# EAGLE schematic EEZ PSU Arduino shield+BP r3B4 (EAGLE 6.1)
Assembly variants: Farnell, TME

## Sheet 1 of 5: Binding posts relays, LED driver
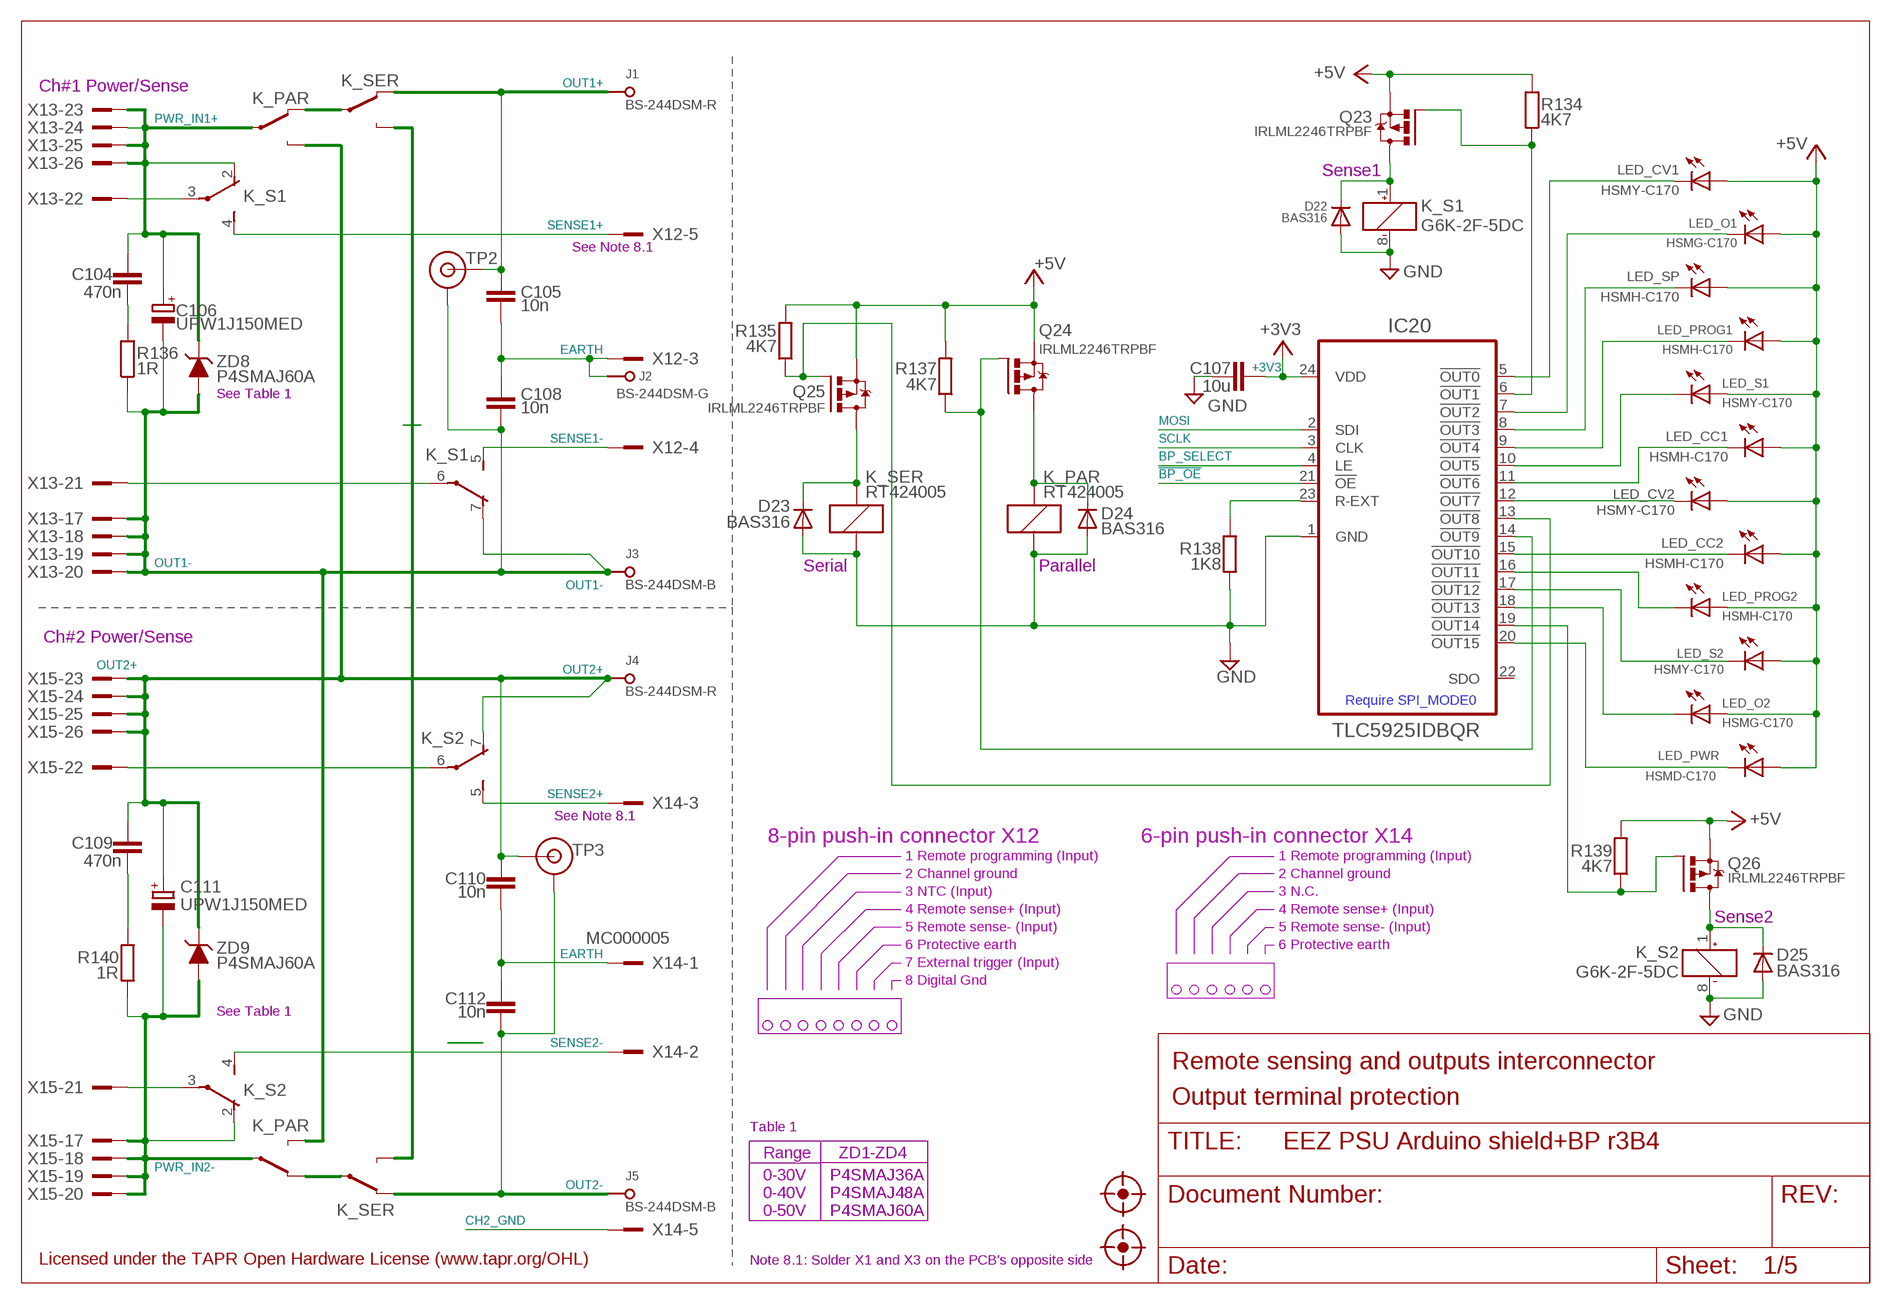
[diagram p0: schematic, sheet 1]

### Parts
C104  470n  C-EUC0805  [C0805]
C105  10n  C-EUC0805  [C0805]
C106  UPW1J150MED  ECAPEEEFK+2.5MM  [CAPAE660X610N_COMBO2]
C107  10u  C-EUC1210  [C1210]
C108  10n  C-EUC0805  [C0805]
C109  470n  C-EUC0805  [C0805]
C110  10n  C-EUC0805  [C0805]
C111  UPW1J150MED  ECAPEEEFK+2.5MM  [CAPAE660X610N_COMBO2]
C112  10n  C-EUC0805  [C0805]
D22  BAS316  DIODE-SOD323-W  [SOD323-W]
D23  BAS316  DIODE-SOD323-W  [SOD323-W]
D24  BAS316  DIODE-SOD323-W  [SOD323-W]
D25  BAS316  DIODE-SOD323-W  [SOD323-W]
FM5  FIDUCIAL_2  [FIDUCIAL_DUAL]
FM6  FIDUCIAL_2  [FIDUCIAL_DUAL]
IC20  TLC5925IDBQR  [SOP63P600X175-24N]
J1  BS-244DSM-R  BINDING_POST-2  [BP_5_12]
J2  BS-244DSM-G  BINDING_POST-2  [BP_5_12]
J3  BS-244DSM-B  BINDING_POST-2  [BP_5_12]
J4  BS-244DSM-R  BINDING_POST-2  [BP_5_12]
J5  BS-244DSM-B  BINDING_POST-2  [BP_5_12]
K_PAR  RT424005  RELAY_RT314012-2  [RT-C/016A5_ROUND]
K_S1  G6K-2F-5DC  G6K-2F  [G6K-2F]
K_S2  G6K-2F-5DC  G6K-2F  [G6K-2F]
K_SER  RT424005  RELAY_RT314012-2  [RT-C/016A5_ROUND]
LED_CC1  HSMH-C170  LED0805  [LED_0805]
LED_CC2  HSMH-C170  LED0805  [LED_0805]
LED_CV1  HSMY-C170  LED0805  [LED_0805]
LED_CV2  HSMY-C170  LED0805  [LED_0805]
LED_O1  HSMG-C170  LED0805  [LED_0805]
LED_O2  HSMG-C170  LED0805  [LED_0805]
LED_PROG1  HSMH-C170  LED0805  [LED_0805]
LED_PROG2  HSMH-C170  LED0805  [LED_0805]
LED_PWR  HSMD-C170  LED0805  [LED_0805]
LED_S1  HSMY-C170  LED0805  [LED_0805]
LED_S2  HSMY-C170  LED0805  [LED_0805]
LED_SP  HSMH-C170  LED0805  [LED_0805]
Q23  IRLML2246TRPBF  [SOT95P237X112-3N]
Q24  IRLML2246TRPBF  [SOT95P237X112-3N]
Q25  IRLML2246TRPBF  [SOT95P237X112-3N]
Q26  IRLML2246TRPBF  [SOT95P237X112-3N]
R134  4K7  R-EU_R0805  [R0805]
R135  4K7  R-EU_R0805  [R0805]
R136  1R  R-EU_R0805  [R0805]
R137  4K7  R-EU_R0805  [R0805]
R138  1K8  R-EU_R0805  [R0805]
R139  4K7  R-EU_R0805  [R0805]
R140  1R  R-EU_R0805  [R0805]
TP2  TEST_POINT  [TP_1.1MM]
TP3  TEST_POINT  [TP_1.1MM]
X12  MC000006  MC000006MIRROR  [MC000006_MIRROR]
X13  TSW-113-07-F-D  [TSW-113-07-F-D]
X14  MC000005  MC000005MIRROR  [MC000005_MIRROR]
X15  TSW-113-07-F-D  [TSW-113-07-F-D]
ZD8  P4SMAJ60A  PSMAXX  [DO214AC]
ZD9  P4SMAJ60A  PSMAXX  [DO214AC]

### Nets
!BP_OE: IC20.21(!OE) ; also sheet 2
!BP_OUT0: IC20.5(!OUT0) LED_CV1.C
!BP_OUT1: IC20.6(!OUT1) Q23.1(G) R134.1
!BP_OUT2: IC20.7(!OUT2) LED_O1.C
!BP_OUT3: IC20.8(!OUT3) LED_SP.C
!BP_OUT4: IC20.9(!OUT4) LED_PROG1.C
!BP_OUT5: IC20.10(!OUT5) LED_S1.C
!BP_OUT6: IC20.11(!OUT6) LED_CC1.C
!BP_OUT7: IC20.12(!OUT7) LED_CV2.C
!BP_OUT8: IC20.13(!OUT8) Q25.1(G) R135.1
!BP_OUT9: IC20.14(!OUT9) Q24.1(G) R137.1
!BP_OUT10: IC20.15(!OUT10) LED_CC2.C
!BP_OUT12: IC20.17(!OUT12) LED_S2.C
!BP_OUT13: IC20.18(!OUT13) LED_O2.C
!BP_OUT14: IC20.19(!OUT14) Q26.1(G) R139.1
!BP_OUT15: IC20.20(!OUT15) LED_PWR.C
+3V3: C107.1 IC20.24(VDD) ; also sheet 2,3,4,5
+5V: LED_CC1.A LED_CC2.A LED_CV1.A LED_CV2.A LED_O1.A LED_O2.A LED_PROG1.A LED_PROG2.A LED_PWR.A LED_S1.A LED_S2.A LED_SP.A Q23.2(S) Q24.2(S) Q25.2(S) Q26.2(S) R134.2 R135.2 R137.2 R139.2 ; also sheet 2,3,4,5
BP_SELECT: IC20.4(LE) ; also sheet 2
CH2_GND: X14.5 X14.5.1 ; also sheet 2,4
EARTH: C105.2 C108.1 C110.2 C112.1 J2.P$1 X12.3 X12.3.1 X14.1 X14.1.1 ; also sheet 3
GND [gnd]: C107.2 D22.A D23.A D24.A D25.A IC20.1(GND) K_PAR.A1(K:C2) K_S1.8(1:-) K_S2.8(1:-) K_SER.A1(K:C2) R138.1 ; also sheet 2,3,4,5
MOSI: IC20.2(SDI) ; also sheet 2,3,5
N$92: D22.C K_S1.1(1:+) Q23.3(D)
N$93: D25.C K_S2.1(1:+) Q26.3(D)
N$94: C104.2 R136.2
N$95: C109.2 R140.2
N$96: IC20.16(!OUT11) LED_PROG2.C
N$97: K_SER.14A(-1:O) K_SER.14B(-2:O)
N$98: K_PAR.12A(-1:S) K_SER.11B(-2:P)
N$99: K_PAR.12B(-2:S) K_SER.11A(-1:P)
N$155: D23.C K_SER.A2(K:C1) Q25.3(D)
N$156: D24.C K_PAR.A2(K:C1) Q24.3(D)
N$306: IC20.23(R-EXT) R138.2
OUT1+: C105.1 J1.P$1 K_SER.12B(-2:S) TP2.TIP
OUT1-: C106.2(-) C106.2.1(-) C108.2 J3.P$1 K_PAR.14B(-2:O) K_S1.7(3:O) R136.1 TP2.GND X13.17 X13.18 X13.19 X13.20 ZD8.A
OUT2+: C109.1 C110.1 C111.1(+) C111.1.1(+) J4.P$1 K_PAR.14A(-1:O) K_S2.7(3:O) TP3.TIP X15.23 X15.24 X15.25 X15.26 ZD9.C
OUT2-: C112.2 J5.P$1 K_SER.12A(-1:S) TP3.GND
PWR_IN1+: C104.1 C106.1(+) C106.1.1(+) K_PAR.11A(-1:P) K_S1.2(2:O) X13.23 X13.24 X13.25 X13.26 ZD8.C
PWR_IN2-: C111.2(-) C111.2.1(-) K_PAR.11B(-2:P) K_S2.2(2:O) R140.1 X15.17 X15.18 X15.19 X15.20 ZD9.A
SCLK: IC20.3(CLK) ; also sheet 2,3,5
SENSE1+: K_S1.4(2:S) X12.5 X12.5.1
SENSE1-: K_S1.5(3:S) X12.4 X12.4.1
SENSE1_IN+: K_S1.3(2:P) X13.22
SENSE1_IN-: K_S1.6(3:P) X13.21
SENSE2+: K_S2.5(3:S) X14.3 X14.3.1
SENSE2-: K_S2.4(2:S) X14.2 X14.2.1
SENSE2_IN+: K_S2.6(3:P) X15.22
SENSE2_IN-: K_S2.3(2:P) X15.21
Unconnected: IC20.22(SDO) X14.4 X14.4.1

### Notes on the sheet
- Ch#1 Power/Sense
- Sense1
- See Note 8.1
- See Table 1
- Serial | Parallel
- Ch#2 Power/Sense
- Require SPI_MODE0
- See Note 8.1
- 8-pin push-in connector X12 | 6-pin push-in connector X14
- 1 Remote programming (Input) | 1 Remote programming (Input)
- 2 Channel ground | 2 Channel ground
- 3 NTC (Input) | 3 N.C.
- 4 Remote sense+ (Input) | 4 Remote sense+ (Input)
- Sense2
- 5 Remote sense- (Input) | 5 Remote sense- (Input)
- 6 Protective earth | 6 Protective earth
- 7 External trigger (Input)
- 8 Digital Gnd
- See Table 1
- Remote sensing and outputs interconnector
- Output terminal protection
- Table 1
- Range | ZD1-ZD4
- 0-30V | P4SMAJ36A
- 0-40V | P4SMAJ48A
- 0-50V | P4SMAJ60A
- Licensed under the TAPR Open Hardware License (www.tapr.org/OHL) | Note 8.1: Solder X1 and X3 on the PCB's opposite side

## Sheet 2 of 5: Isolators, Arduino
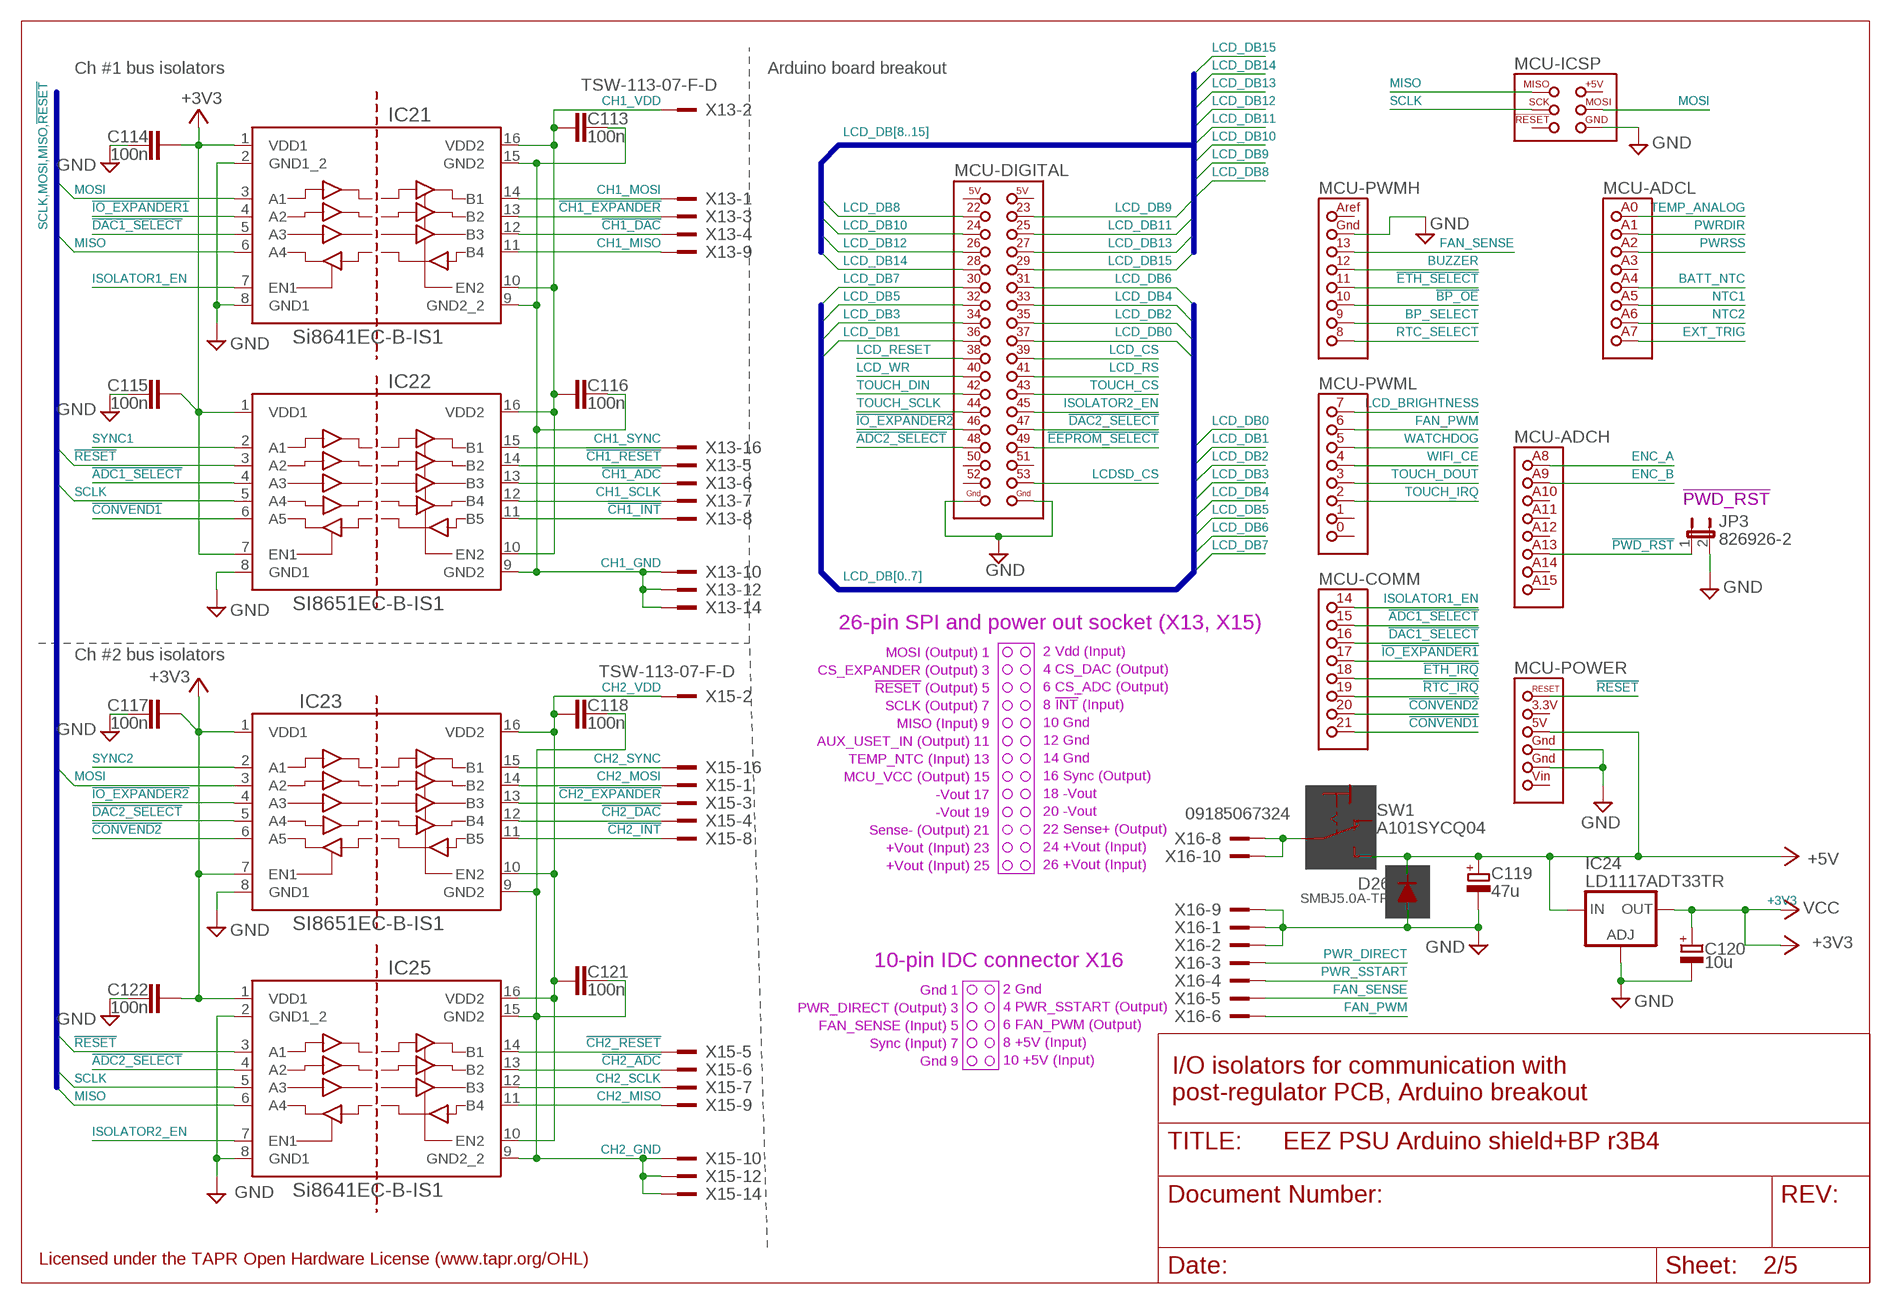
[diagram p1: schematic, sheet 2]

### Parts
C113  100n  C-EUC0603  [C0603]
C114  100n  C-EUC0603  [C0603]
C115  100n  C-EUC0603  [C0603]
C116  100n  C-EUC0603  [C0603]
C117  100n  C-EUC0603  [C0603]
C118  100n  C-EUC0603  [C0603]
C119  47u  ECAPPANASONIC_H  [CAPAE660X610N]
C120  10u  ECAPPANASONIC_C  [PANASONIC_C]
C121  100n  C-EUC0603  [C0603]
C122  100n  C-EUC0603  [C0603]
D26  SMBJ5.0A-TR  DIODEDO214AA  [DO214AA]
IC21  Si8641EC-B-IS1  SI8641NSOIC-16  [SOIC-16]
IC22  SI8651EC-B-IS1  SI8651NSOIC-16  [SOIC-16]
IC23  SI8651EC-B-IS1  SI8651NSOIC-16  [SOIC-16]
IC24  LD1117ADT33TR  LD117ADT33TR  [DPACK]
IC25  Si8641EC-B-IS1  SI8641NSOIC-16  [SOIC-16]
JP3  826926-2  JP1E  [JP1]
MCU  Arduino Due  ARDUINO_MEGA+ICSPMIRROR  [ARDUINO+ICSP_MIRROR]
SW1  A101SYCQ04  M9040P  [M9040P]
X16  09185067324  IDC-10PINBLACK  [IDC-10PIN]

### Nets
!ADC1_SELECT: IC22.4(A3) MCU.15
!ADC2_SELECT: IC25.4(A2) MCU.48(-DIGITAL:48(PL3))
!BP_OE: MCU.10 ; also sheet 1
!CH1_ADC: IC22.13(B3) X13.6
!CH1_DAC: IC21.12(B3) X13.4
!CH1_EXPANDER: IC21.13(B2) X13.3
!CH1_INT: IC22.11(B5) X13.8
!CH1_RESET: IC22.14(B2) X13.5
!CH2_ADC: IC25.13(B2) X15.6
!CH2_DAC: IC23.12(B4) X15.4
!CH2_EXPANDER: IC23.13(B3) X15.3
!CH2_INT: IC23.11(B5) X15.8
!CH2_RESET: IC25.14(B1) X15.5
!CONVEND1: IC22.6(A5) MCU.21
!CONVEND2: IC23.6(A5) MCU.20
!DAC1_SELECT: IC21.5(A3) MCU.16
!DAC2_SELECT: IC23.5(A4) MCU.47(-DIGITAL:47(PL4))
!EEPROM_SELECT: MCU.49(-DIGITAL:49(PL2)) ; also sheet 3
!ETH_IRQ: MCU.18 ; also sheet 3,5
!ETH_SELECT: MCU.11 ; also sheet 3,5
!IO_EXPANDER1: IC21.4(A2) MCU.17
!IO_EXPANDER2: IC23.4(A3) MCU.46(-DIGITAL:46(PL5))
!PWD_RST: JP3.1 MCU.A13(-ADCH:ADC13)
!RESET: IC22.3(A2) IC25.3(A1) MCU.RESET(-POWER:!RESET) ; also sheet 3,4,5
!RTC_IRQ: MCU.19 ; also sheet 3
+3V3: C114.1 C115.1 C117.1 C120.1(+) C122.1 IC21.1(VDD1) IC22.1(VDD1) IC22.7(EN1) IC23.1(VDD1) IC23.7(EN1) IC24.4(OUT) IC25.1(VDD1) ; supply symbol labelled VCC ; also sheet 1,3,4,5
+5V: C119.1(+) D26.C IC24.3(IN) MCU.5V(-POWER:5V) SW1.3(S) ; also sheet 1,3,4,5
BATT_NTC: MCU.A4(-ADCL:ADC4) ; also sheet 4
BP_SELECT: MCU.9(-PWMH:9(PH6)) ; also sheet 1
BUZZER: MCU.12 ; also sheet 3
CH1_GND: C113.2 C116.2 IC21.9(GND2_2) IC21.15(GND2) IC22.9(GND2) X13.10 X13.12 X13.14 ; also sheet 4
CH1_MISO: IC21.11(B4) X13.9
CH1_MOSI: IC21.14(B1) X13.1
CH1_SCLK: IC22.12(B4) X13.7
CH1_SYNC: IC22.15(B1) X13.16
CH1_VDD: C113.1 C116.1 IC21.10(EN2) IC21.16(VDD2) IC22.10(EN2) IC22.16(VDD2) X13.2 ; also sheet 4
CH2_GND: C118.2 C121.2 IC23.9(GND2) IC25.9(GND2_2) IC25.15(GND2) X15.10 X15.12 X15.14 ; also sheet 1,4
CH2_MISO: IC25.11(B4) X15.9
CH2_MOSI: IC23.14(B2) X15.1
CH2_SCLK: IC25.12(B3) X15.7
CH2_SYNC: IC23.15(B1) X15.16
CH2_VDD: C118.1 C121.1 IC23.10(EN2) IC23.16(VDD2) IC25.10(EN2) IC25.16(VDD2) X15.2
ENC_A: MCU.A8(-ADCH:ADC8) ; also sheet 5
ENC_B: MCU.A9(-ADCH:ADC9) ; also sheet 5
EXT_TRIG: MCU.A7(-ADCL:ADC7) ; also sheet 4
FAN_PWM: MCU.6(-PWML:6(PH3)) X16.6
FAN_SENSE: MCU.13 X16.5
GND [gnd]: C114.2 C115.2 C117.2 C119.2(-) C120.2(-) C122.2 D26.A IC21.2(GND1_2) IC21.8(GND1) IC22.8(GND1) IC23.8(GND1) IC24.1(ADJ) IC25.2(GND1_2) IC25.8(GND1) JP3.2 MCU.GND1(-POWER:GND1) MCU.GND2(-POWER:GND2) MCU.GND3(-DIGITAL:GND3) MCU.GND4(-DIGITAL:GND4) MCU.GND(-PWMH:GND) MCU.ICSP_GND(-ICSP:GND) X16.1 X16.2 X16.9 ; also sheet 1,3,4,5
ISOLATOR1_EN: IC21.7(EN1) MCU.14
ISOLATOR2_EN: IC25.7(EN1) MCU.45(-DIGITAL:45(PL6))
LCD_BRIGHTNESS: MCU.7(-PWML:7(PH4)) ; also sheet 3
LCD_CS: MCU.39(-DIGITAL:39(PC0)) ; also sheet 3
LCD_DB0: MCU.37(-DIGITAL:37(PC2)) ; also sheet 3
LCD_DB1: MCU.36(-DIGITAL:36(PC3)) ; also sheet 3
LCD_DB2: MCU.35(-DIGITAL:35(PC4)) ; also sheet 3
LCD_DB3: MCU.34(-DIGITAL:34(PC5)) ; also sheet 3
LCD_DB4: MCU.33(-DIGITAL:33(PC6)) ; also sheet 3
LCD_DB5: MCU.32(-DIGITAL:32(PC7)) ; also sheet 3
LCD_DB6: MCU.31(-DIGITAL:31(PA7)) ; also sheet 3
LCD_DB7: MCU.30(-DIGITAL:30(PA6)) ; also sheet 3
LCD_DB8: MCU.22 ; also sheet 3
LCD_DB9: MCU.23 ; also sheet 3
LCD_DB10: MCU.24(-DIGITAL:24(PA0)) ; also sheet 3
LCD_DB11: MCU.25(-DIGITAL:25(PA1)) ; also sheet 3
LCD_DB12: MCU.26(-DIGITAL:26(PA2)) ; also sheet 3
LCD_DB13: MCU.27(-DIGITAL:27(PA3)) ; also sheet 3
LCD_DB14: MCU.28(-DIGITAL:28(PA4)) ; also sheet 3
LCD_DB15: MCU.29(-DIGITAL:29(PA5)) ; also sheet 3
LCD_RESET: MCU.38(-DIGITAL:38(PC1)) ; also sheet 3
LCD_RS: MCU.41(-DIGITAL:41(PG2)) ; also sheet 3
LCD_WR: MCU.40(-DIGITAL:40(PD7)) ; also sheet 3
LCDSD_CS: MCU.53(-DIGITAL:53(PB2/MOSI)) ; also sheet 3
MISO: IC21.6(A4) IC25.6(A4) MCU.ICSP_MISO(-ICSP:MISO) ; also sheet 3,5
MOSI: IC21.3(A1) IC23.3(A2) MCU.ICSP_MOSI(-ICSP:MOSI) ; also sheet 1,3,5
N$100: SW1.2(P) X16.8 X16.10
NTC1: MCU.A5(-ADCL:ADC5) ; also sheet 3
NTC2: MCU.A6(-ADCL:ADC6) ; also sheet 3
PWR_DIRECT: X16.3 ; also sheet 4
PWR_SSTART: X16.4 ; also sheet 4
PWRDIR: MCU.A1(-ADCL:ADC1) ; also sheet 4
PWRSS: MCU.A2(-ADCL:ADC2) ; also sheet 4
RTC_SELECT: MCU.8(-PWMH:8(PH5)) ; also sheet 3
SCLK: IC22.5(A4) IC25.5(A3) MCU.ICSP_SCK(-ICSP:SCK) ; also sheet 1,3,5
SYNC1: IC22.2(A1) ; also sheet 5
SYNC2: IC23.2(A1) ; also sheet 5
TEMP_ANALOG: MCU.A0(-ADCL:ADC0) ; also sheet 3
TOUCH_CS: MCU.43(-DIGITAL:43(PG0)) ; also sheet 3
TOUCH_DIN: MCU.42(-DIGITAL:42(PG1)) ; also sheet 3
TOUCH_DOUT: MCU.3(-PWML:3(PE5)) ; also sheet 3
TOUCH_IRQ: MCU.2(-PWML:2(PE4)) ; also sheet 3
TOUCH_SCLK: MCU.44(-DIGITAL:44(PL7)) ; also sheet 3
WATCHDOG: MCU.5(-PWML:5(PE3)) ; also sheet 4
WIFI_CE: MCU.4(-PWML:4(PG5)) ; also sheet 5
Unconnected: MCU.0(-PWML:0(PE0)) MCU.1(-PWML:1(PE1)) MCU.3.3V(-POWER:3V3) MCU.5V(1)(-DIGITAL:5V(1)) MCU.5V(2)(-DIGITAL:5V(2)) MCU.50(-DIGITAL:50(PL1/MISO)) MCU.51(-DIGITAL:51(PL0)) MCU.52(-DIGITAL:52(PB3/SCK)) MCU.A3(-ADCL:ADC3) MCU.A10(-ADCH:ADC10) MCU.A11(-ADCH:ADC11) MCU.A12(-ADCH:ADC12) MCU.A14(-ADCH:ADC14) MCU.A15(-ADCH:ADC15) MCU.AREF(-PWMH:AREF) MCU.ICSP_+5V(-ICSP:+5V) MCU.ICSP_RESET(-ICSP:!RESET) MCU.VIN(-POWER:VIN) SW1.1(O)

### Buses
SCLK,MOSI,MISO,!RESET
LCD_DB[8..15]
LCD_DB[0..7]

### Notes on the sheet
- Ch #1 bus isolators | Arduino board breakout
- !PWD_RST
- 26-pin SPI and power out socket (X13, X15)
- MOSI (Output) 1
- 2 Vdd (Input)
- Ch #2 bus isolators
- CS_EXPANDER (Output) 3
- 4 CS_DAC (Output)
- !RESET! (Output) 5
- 6 CS_ADC (Output)
- SCLK (Output) 7
- 8 !INT! (Input)
- MISO (Input) 9
- 10 Gnd
- AUX_USET_IN (Output) 11
- 12 Gnd
- TEMP_NTC (Input) 13
- 14 Gnd
- MCU_VCC (Output) 15
- 16 Sync (Output)
- -Vout 17
- 18 -Vout
- -Vout 19
- 20 -Vout
- Sense- (Output) 21
- 22 Sense+ (Output)
- +Vout (Input) 23
- 24 +Vout (Input)
- +Vout (Input) 25
- 26 +Vout (Input)
- 10-pin IDC connector X16
- Gnd 1
- 2 Gnd
- PWR_DIRECT (Output) 3
- 4 PWR_SSTART (Output)
- FAN_SENSE (Input) 5
- 6 FAN_PWM (Output)
- Sync (Input) 7
- 8 +5V (Input)
- Gnd 9
- 10 +5V (Input)
- I/O isolators for communication with
- post-regulator PCB, Arduino breakout
- Licensed under the TAPR Open Hardware License (www.tapr.org/OHL)

## Sheet 3 of 5: SPI peripherals, TFT display
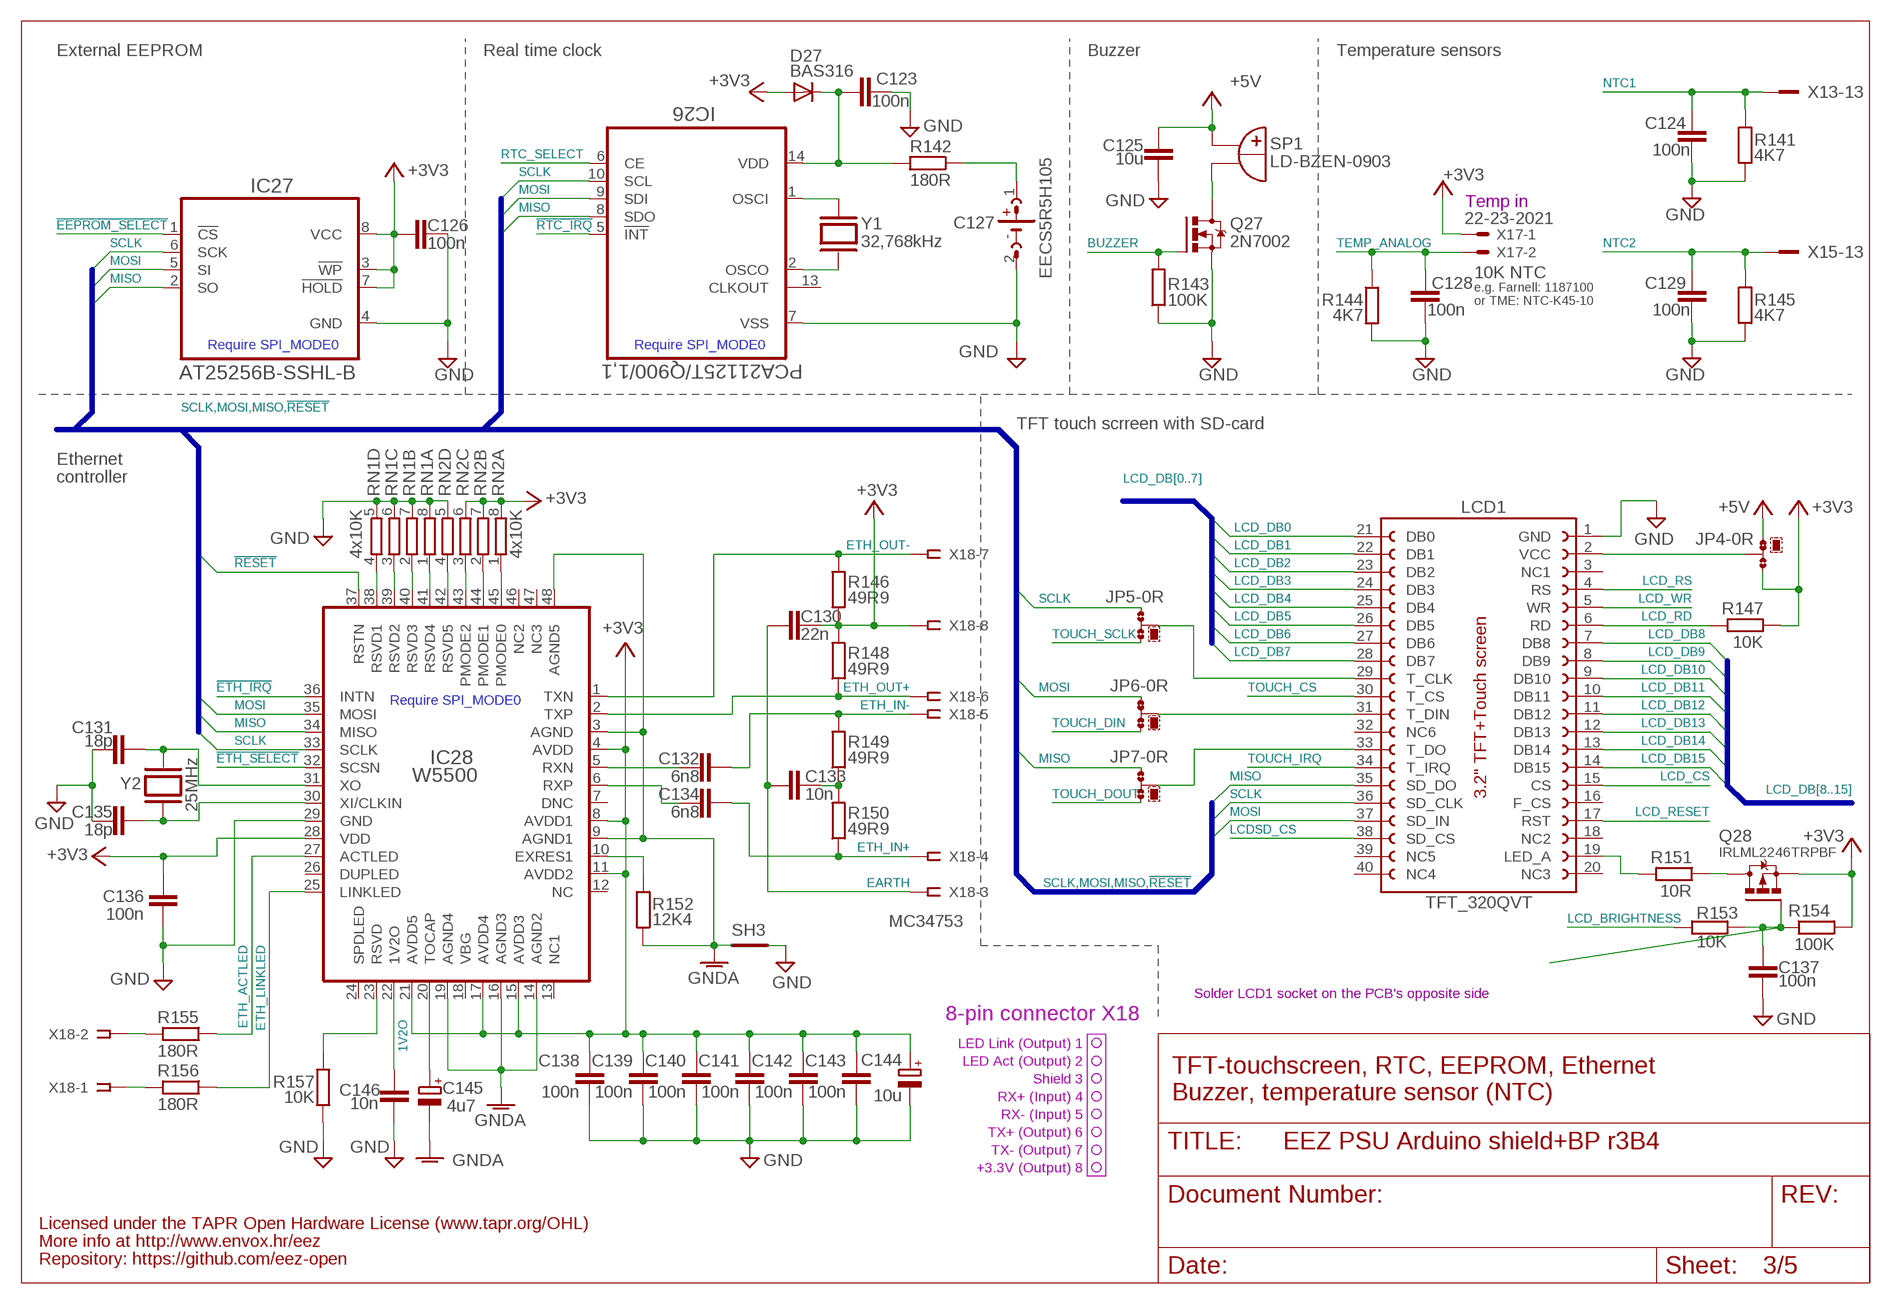
[diagram p2: schematic, sheet 3]

### Parts
C123  100n  C-EUC0603  [C0603]
C124  100n  C-EUC0603  [C0603]
C125  10u  C-EUC1210  [C1210]
C126  100n  C-EUC0603  [C0603]
C127  EECS5R5H105  SUPER_CAP  [SG-R20MM]
C128  100n  C-EUC0603  [C0603]
C129  100n  C-EUC0603  [C0603]
C130  22n  C-EUC0805  [C0805]
C131  18p  C-EUC0805  [C0805]
C132  6n8  C-EUC0603  [C0603]
C133  10n  C-EUC0805  [C0805]
C134  6n8  C-EUC0603  [C0603]
C135  18p  C-EUC0805  [C0805]
C136  100n  C-EUC0603  [C0603]
C137  100n  C-EUC0603  [C0603]
C138  100n  C-EUC0603  [C0603]
C139  100n  C-EUC0603  [C0603]
C140  100n  C-EUC0603  [C0603]
C141  100n  C-EUC0603  [C0603]
C142  100n  C-EUC0603  [C0603]
C143  100n  C-EUC0603  [C0603]
C144  10u  ECAP1206  [EC1206]
C145  4u7  ECAP1206  [EC1206]
C146  10n  C-EUC0805  [C0805]
D27  BAS316  DIODE-SOD323-W  [SOD323-W]
IC26  PCA21125T/Q900/1,1  PCA21125TSSOP-14  [SOP65P640X120-14N]
IC27  AT25256B-SSHL-B  AT25XXXSOIC8  [SOIC127P600X175-8N]
IC28  W5500  [TQFP48-7X7]
JP4  0R-JUMPA  [A0R-JMP]
JP5  0R-JUMPA  [A0R-JMP]
JP6  0R-JUMPA  [A0R-JMP]
JP7  0R-JUMPA  [A0R-JMP]
LCD1  TFT_320QVT  LCD_TFT_320QVTMIRROR  [LCD_TFT_320QVT_MIRROR]
Q27  2N7002  [SOT103P240X110-3N]
Q28  IRLML2246TRPBF  [SOT95P237X112-3N]
R141  4K7  R-EU_R0805  [R0805]
R142  180R  R-EU_R0805  [R0805]
R143  100K  R-EU_R0805  [R0805]
R144  4K7  R-EU_R0805  [R0805]
R145  4K7  R-EU_R0805  [R0805]
R146  49R9  R-EU_R0805  [R0805]
R147  10K  R-EU_R0805  [R0805]
R148  49R9  R-EU_R0805  [R0805]
R149  49R9  R-EU_R0805  [R0805]
R150  49R9  R-EU_R0805  [R0805]
R151  10R  R-EU_R1206  [R1206]
R152  12K4  R-EU_R0805  [R0805]
R153  10K  R-EU_R0805  [R0805]
R154  100K  R-EU_R0805  [R0805]
R155  180R  R-EU_R0805  [R0805]
R156  180R  R-EU_R0805  [R0805]
R157  10K  R-EU_R0805  [R0805]
RN1  4x10K  R_ARRAY4  [CAY16]
RN2  4x10K  R_ARRAY4  [CAY16]
SH3  SHORTNOHOLE  [SHORT_NOHOLE]
SP1  LD-BZEN-0903  BUZZER-2  [LD-BZEN-0903]
X17  22-23-2021  [22-23-2021]
X18  MC34753  SSW-108-02-S-S  [SSW-108-02-S-S]
Y1  32,768kHz  XTALR26  [R26_XTAL]
Y2  25MHz  XTALSMD  [HC-49/4H]

### Nets
1V2O: C146.2 IC28.22(1V2O)
!EEPROM_SELECT: IC27.1(!CS) ; also sheet 2
!ETH_IRQ: IC28.36(INTN) ; also sheet 2,5
!ETH_SELECT: IC28.32(SCSN) ; also sheet 2,5
!RESET: IC28.37(RSTN) ; also sheet 2,4,5
!RTC_IRQ: IC26.5(!INT) ; also sheet 2
+3V3: C126.1 C130.1 C136.2 C138.1 C139.1 C140.1 C141.1 C142.1 C143.1 C144.+ D27.A IC27.3(!WP) IC27.7(!HOLD) IC27.8(VCC) IC28.4(AVDD) IC28.8(AVDD1) IC28.11(AVDD2) IC28.15(AVDD3) IC28.17(AVDD4) IC28.21(AVDD5) IC28.28(VDD) JP4.3 Q28.2(S) R146.1 R147.2 R148.2 R154.2 RN2.6 RN2.7 RN2.8 X17.1 X18.8 ; also sheet 1,2,4,5
+5V: C125.2 JP4.1 SP1.+B(+) ; also sheet 1,2,4,5
BUZZER: Q27.1(G) R143.2 ; also sheet 2
EARTH: C130.2 C133.2 X18.3 ; also sheet 1
ETH_ACTLED: IC28.27(ACTLED) R155.1
ETH_IN+: C134.1 R150.1 X18.4
ETH_IN-: C132.1 R149.2 X18.5
ETH_LINKLED: IC28.25(LINKLED) R156.1
ETH_OUT+: IC28.2(TXP) R148.1 X18.6
ETH_OUT-: IC28.1(TXN) R146.2 X18.7
GND [gnd]: C123.1 C124.1 C125.1 C126.2 C127.2(-) C128.1 C129.1 C131.2 C135.2 C136.1 C137.1 C138.2 C139.2 C140.2 C141.2 C142.2 C143.2 C144.- C146.1 IC26.7(VSS) IC27.4(GND) IC28.29(GND) LCD1.1(GND) Q27.2(S) R141.2 R143.1 R144.2 R145.2 R157.1 RN1.5 RN1.6 RN1.7 RN1.8 RN2.5 SH3.P$1(GND_A) ; also sheet 1,2,4,5
GNDA [gnd]: C145.- IC28.3(AGND) IC28.9(AGND1) IC28.14(AGND2) IC28.16(AGND3) IC28.19(AGND4) IC28.48(AGND5) R152.1 SH3.P$2(GND_B)
LCD_BRIGHTNESS: R153.1 ; also sheet 2
LCD_CS: LCD1.15(CS) ; also sheet 2
LCD_DB0: LCD1.21(DB0) ; also sheet 2
LCD_DB1: LCD1.22(DB1) ; also sheet 2
LCD_DB2: LCD1.23(DB2) ; also sheet 2
LCD_DB3: LCD1.24(DB3) ; also sheet 2
LCD_DB4: LCD1.25(DB4) ; also sheet 2
LCD_DB5: LCD1.26(DB5) ; also sheet 2
LCD_DB6: LCD1.27(DB6) ; also sheet 2
LCD_DB7: LCD1.28(DB7) ; also sheet 2
LCD_DB8: LCD1.7(DB8) ; also sheet 2
LCD_DB9: LCD1.8(DB9) ; also sheet 2
LCD_DB10: LCD1.9(DB10) ; also sheet 2
LCD_DB11: LCD1.10(DB11) ; also sheet 2
LCD_DB12: LCD1.11(DB12) ; also sheet 2
LCD_DB13: LCD1.12(DB13) ; also sheet 2
LCD_DB14: LCD1.13(DB14) ; also sheet 2
LCD_DB15: LCD1.14(DB15) ; also sheet 2
LCD_RD: LCD1.6(RD) R147.1
LCD_RESET: LCD1.17(RST) ; also sheet 2
LCD_RS: LCD1.4(RS) ; also sheet 2
LCD_WR: LCD1.5(WR) ; also sheet 2
LCDSD_CS: LCD1.38(SD_CS) ; also sheet 2
LED_A: LCD1.19(LED_A) R151.2
MISO: IC26.8(SDO) IC27.2(SO) IC28.34(MISO) JP7.1 LCD1.35(SD_DO) ; also sheet 2,5
MOSI: IC26.9(SDI) IC27.5(SI) IC28.35(MOSI) JP6.1 LCD1.37(SD_IN) ; also sheet 1,2,5
N$101: Q27.3(D) SP1.-B(-)
N$102: JP4.2 LCD1.2(VCC)
N$103: Q28.3(D) R151.1
N$104: JP7.2 LCD1.33(T_DO)
N$105: JP5.2 LCD1.29(T_CLK)
N$106: JP6.2 LCD1.31(T_DIN)
N$107: C127.1(+) R142.1
N$108: IC28.23(RSVD) R157.2
N$109: C123.2 D27.C IC26.14(VDD) R142.2
N$110: IC28.10(EXRES1) R152.2
N$111: C131.1 IC28.31(XO) Y2.1
N$112: C135.1 IC28.30(XI/CLKIN) Y2.2
N$113: C132.2 IC28.5(RXN)
N$115: C134.2 IC28.6(RXP)
N$116: R156.2 X18.1
N$118: R155.2 X18.2
N$119: IC28.43(PMODE2) RN2.3
N$120: IC28.44(PMODE1) RN2.2
N$121: IC28.45(PMODE0) RN2.1
N$122: IC28.42(RSVD5) RN2.4
N$123: IC28.38(RSVD1) RN1.4
N$124: C133.1 R149.1 R150.2
N$126: IC28.39(RSVD2) RN1.3
N$127: IC28.41(RSVD4) RN1.1
N$130: IC28.40(RSVD3) RN1.2
N$132: C137.2 Q28.1(G) R153.2 R154.1
N$133: IC26.1(OSCI) Y1.2
N$134: IC26.2(OSCO) Y1.1
NTC1: C124.2 R141.1 X13.13 ; also sheet 2
NTC2: C129.2 R145.1 X15.13 ; also sheet 2
RTC_SELECT: IC26.6(CE) ; also sheet 2
SCLK: IC26.10(SCL) IC27.6(SCK) IC28.33(SCLK) JP5.1 LCD1.36(SD_CLK) ; also sheet 1,2,5
TEMP_ANALOG: C128.2 R144.1 X17.2 ; also sheet 2
TOCAP: C145.+ IC28.20(TOCAP)
TOUCH_CS: LCD1.30(T_CS) ; also sheet 2
TOUCH_DIN: JP6.3 ; also sheet 2
TOUCH_DOUT: JP7.3 ; also sheet 2
TOUCH_IRQ: LCD1.34(T_IRQ) ; also sheet 2
TOUCH_SCLK: JP5.3 ; also sheet 2
Unconnected: IC26.13(CLKOUT) IC28.7(DNC) IC28.12(NC) IC28.13(NC1) IC28.18(VBG) IC28.24(SPDLED) IC28.26(DUPLED) IC28.46(NC2) IC28.47(NC3) LCD1.3(NC1) LCD1.16(F_CS) LCD1.18(NC2) LCD1.20(NC3) LCD1.32(NC6) LCD1.39(NC5) LCD1.40(NC4)

### Buses
SCLK,MOSI,MISO,!RESET
LCD_DB[0..7]
LCD_DB[8..15]

### Notes on the sheet
- External EEPROM | Real time clock | Buzzer | Temperature sensors
- Temp in
- 10K NTC
- e.g. Farnell: 1187100
- or TME: NTC-K45-10
- Require SPI_MODE0 | Require SPI_MODE0
- TFT touch scrreen with SD-card
- Ethernet
- controller
- Require SPI_MODE0
- Solder LCD1 socket on the PCB's opposite side
- 8-pin connector X18
- LED Link (Output) 1
- LED Act (Output) 2
- Shield 3 | TFT-touchscreen, RTC, EEPROM, Ethernet
- RX+ (Input) 4
- Buzzer, temperature sensor (NTC)
- RX- (Input) 5
- TX+ (Output) 6
- TX- (Output) 7
- +3.3V (Output) 8
- Licensed under the TAPR Open Hardware License (www.tapr.org/OHL)
- More info at http://www.envox.hr/eez
- Repository: https://github.com/eez-open

## Sheet 4 of 5: Reset, load temp, digital input
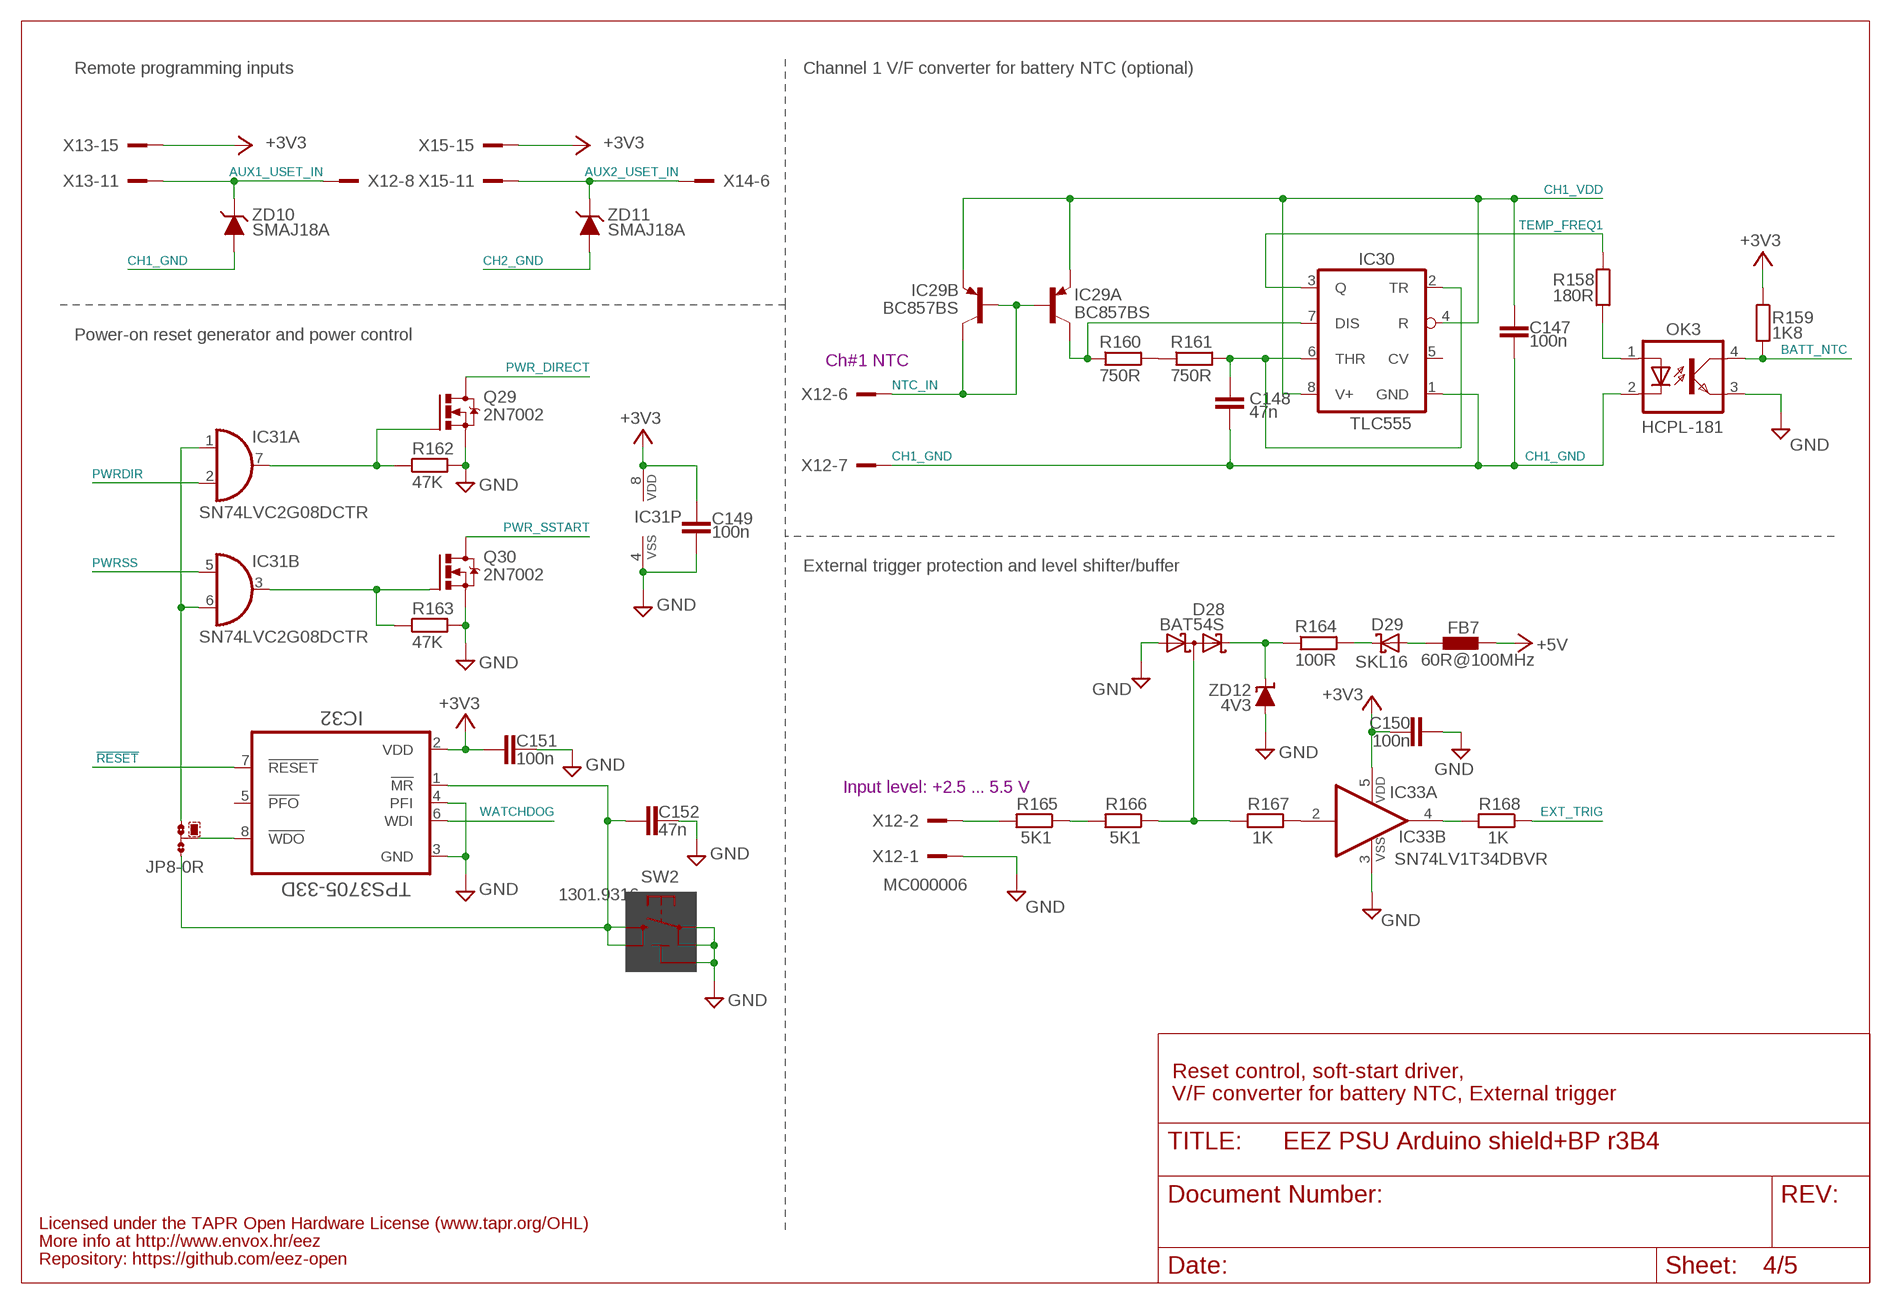
[diagram p3: schematic, sheet 4]

### Parts
C147  100n  C-EUC0603  [C0603]
C148  47n  C-EUC0805  [C0805]
C149  100n  C-EUC0603  [C0603]
C150  100n  C-EUC0603  [C0603]
C151  100n  C-EUC0603  [C0603]
C152  47n  C-EUC0805  [C0805]
D28  BAT54S  [SOT23]
D29  SKL16  SCHOTTKYSOD123  [SOD123]
FB7  60R@100MHz  FERRITE_BEAD0603  [BEAD0603]
IC29  BC857BS  [SOT65P210X110-6N]
IC30  TLC555  LM555SOIC8  [SOIC127P600X175-8N]
IC31  SN74LVC2G08DCTR  [SOP65P400X130-8N]
IC32  TPS3705-33D  TPS3705XX  [SOIC127P600X175-8N]
IC33  SN74LV1T34DBVR  SN74LV1T34  [SOT95P280X145-5N]
JP8  0R-JUMPA  [A0R-JMP]
OK3  HCPL-181  [HCPL-181]
Q29  2N7002  [SOT103P240X110-3N]
Q30  2N7002  [SOT103P240X110-3N]
R158  180R  R-EU_R0805  [R0805]
R159  1K8  R-EU_R0805  [R0805]
R160  750R  R-EU_R0805  [R0805]
R161  750R  R-EU_R0805  [R0805]
R162  47K  R-EU_R0805  [R0805]
R163  47K  R-EU_R0805  [R0805]
R164  100R  R-EU_R0805  [R0805]
R165  5K1  R-EU_R0805  [R0805]
R166  5K1  R-EU_R0805  [R0805]
R167  1K  R-EU_R0805  [R0805]
R168  1K  R-EU_R0805  [R0805]
SW2  1301.9316  TACT_SW  [TACTM-6XN]
ZD10  SMAJ18A  PSMAXX  [DO214AC]
ZD11  SMAJ18A  PSMAXX  [DO214AC]
ZD12  4V3  ZENER-DIODEMINIMELF  [MINIMELF]

### Nets
!MR: C152.2 IC32.1(!MR) JP8.1 SW2.3 SW2.4
!RESET: IC32.7(!RESET) ; also sheet 2,3,5
!RESET1: IC31.1(A:I0) IC31.6(B:I1) JP8.3
+3V3: C149.2 C150.1 C151.2 IC31.8(P:VDD) IC32.2(VDD) IC33.5(B:VDD) R159.1 X13.15 X15.15 ; also sheet 1,2,3,5
+5V: FB7.P$1 ; also sheet 1,2,3,5
AUX1_USET_IN: X12.8 X12.8.1 X13.11 ZD10.C
AUX2_USET_IN: X14.6 X14.6.1 X15.11 ZD11.C
BATT_NTC: OK3.4(COL) R159.2 ; also sheet 2
CH1_GND: C147.2 C148.1 IC30.1(GND) OK3.2(C) X12.7 X12.7.1 ZD10.A ; also sheet 2
CH1_VDD: C147.1 IC29.1(A:E) IC29.4(B:E) IC30.4(R) IC30.8(V+) ; also sheet 2
CH2_GND: ZD11.A ; also sheet 1,2
EXT_TRIG: R168.1 ; also sheet 2
GND [gnd]: C149.1 C150.2 C151.1 C152.1 D28.1(A1) IC31.4(P:VSS) IC32.3(GND) IC32.4(PFI) IC33.3(B:VSS) OK3.3(EMIT) Q29.2(S) Q30.2(S) R162.2 R163.2 SW2.1 SW2.2 SW2.5(5-GND) X12.1 X12.1.1 ZD12.A ; also sheet 1,2,3,5
N$82: IC31.7(A:O) Q29.1(G) R162.1
N$136: C148.2 IC30.2(TR) IC30.6(THR) R161.2
N$137: IC29.6(A:C) IC30.7(DIS) R160.1
N$138: OK3.1(A) R158.2
N$139: D28.3(C1A2) R166.1 R167.2
N$140: IC33.2(A:I) R167.1
N$141: IC33.4(A:O) R168.2
N$142: R165.2 X12.2 X12.2.1
N$144: D28.2(C2) R164.1 ZD12.C
N$148: D29.C R164.2
N$149: D29.A FB7.P$2
N$151: IC32.8(!WDO) JP8.2
N$154: IC31.3(B:O) Q30.1(G) R163.1
N$164: R165.1 R166.2
N$172: R160.2 R161.1
NTC_IN: IC29.2(A:B) IC29.3(B:C) IC29.5(B:B) X12.6 X12.6.1
PWR_DIRECT: Q29.3(D) ; also sheet 2
PWR_SSTART: Q30.3(D) ; also sheet 2
PWRDIR: IC31.2(A:I1) ; also sheet 2
PWRSS: IC31.5(B:I0) ; also sheet 2
TEMP_FREQ1: IC30.3(Q) R158.1
WATCHDOG: IC32.6(WDI) ; also sheet 2
Unconnected: IC30.5(CV) IC32.5(!PFO)

### Notes on the sheet
- Remote programming inputs | Channel 1 V/F converter for battery NTC (optional)
- Power-on reset generator and power control
- Ch#1 NTC
- External trigger protection and level shifter/buffer
- Input level: +2.5 ... 5.5 V
- Reset control, soft-start driver,
- V/F converter for battery NTC, External trigger
- Licensed under the TAPR Open Hardware License (www.tapr.org/OHL)
- More info at http://www.envox.hr/eez
- Repository: https://github.com/eez-open

## Sheet 5 of 5: Optional conn., Master sync
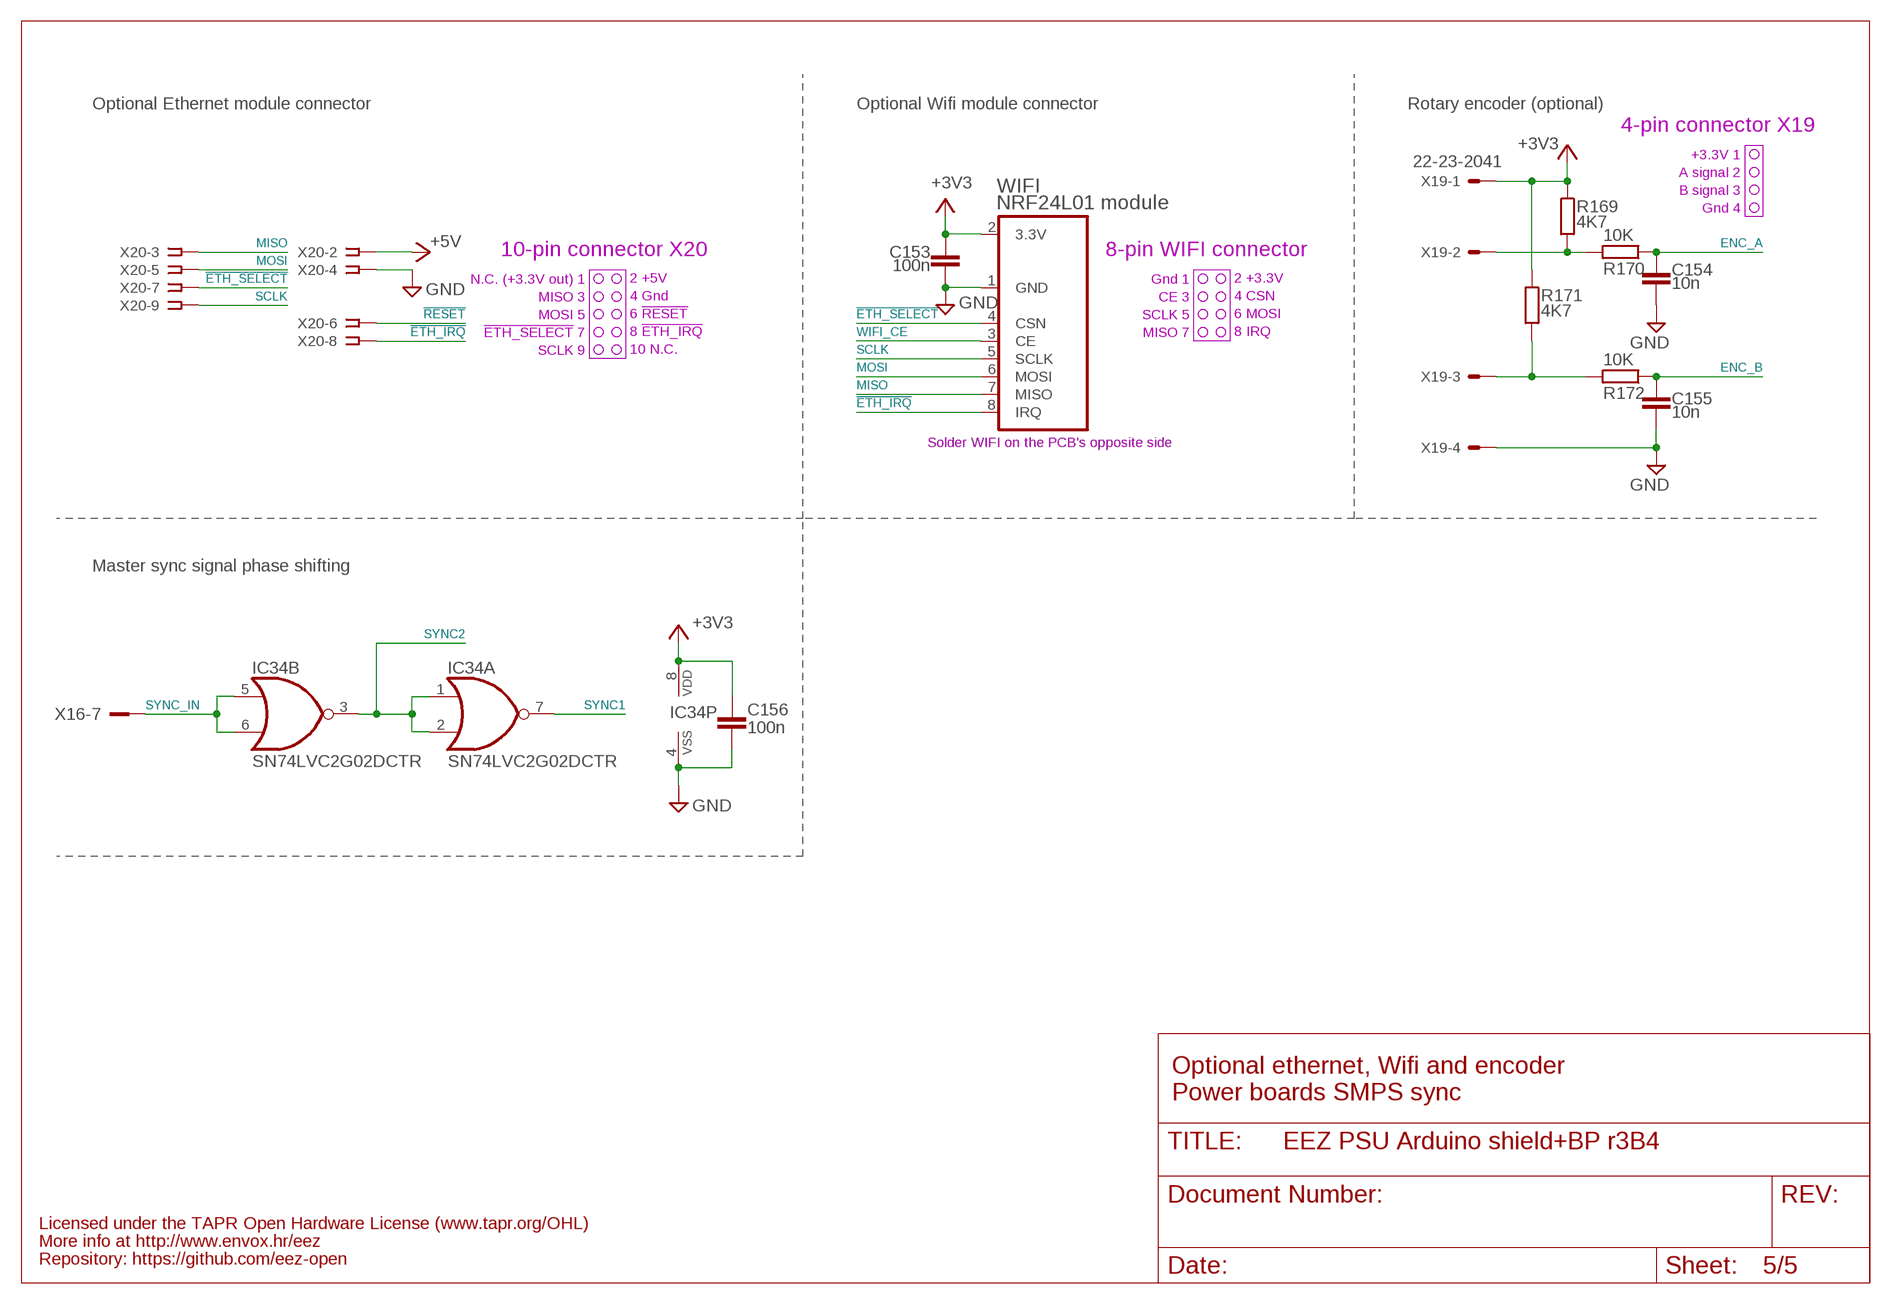
[diagram p4: schematic, sheet 5]

### Parts
C153  100n  C-EUC0603  [C0603]
C154  10n  C-EUC0805  [C0805]
C155  10n  C-EUC0805  [C0805]
C156  100n  C-EUC0603  [C0603]
IC34  SN74LVC2G02DCTR  [SOP65P400X130-8N]
R169  4K7  R-EU_R0805  [R0805]
R170  10K  R-EU_R0805  [R0805]
R171  4K7  R-EU_R0805  [R0805]
R172  10K  R-EU_R0805  [R0805]
WIFI  NRF24L01 module  MOD-NRF24L01MIRROR  [MOD-NRF24L01_MIRROR]
X19  22-23-2041  [22-23-2041]
X20  SSW-105-02-S-D  [SSW-105-02-S-D]

### Nets
!ETH_IRQ: WIFI.8(IRQ) X20.8 ; also sheet 2,3
!ETH_SELECT: WIFI.4(CSN) X20.7 ; also sheet 2,3
!RESET: X20.6 ; also sheet 2,3,4
+3V3: C153.1 C156.1 IC34.8(P:VDD) R169.1 R171.1 WIFI.2(3.3V) X19.1 ; also sheet 1,2,3,4
+5V: X20.2 ; also sheet 1,2,3,4
ENC_A: C154.2 R170.1 ; also sheet 2
ENC_B: C155.1 R172.1 ; also sheet 2
GND [gnd]: C153.2 C154.1 C155.2 C156.2 IC34.4(P:VSS) WIFI.1(GND) X19.4 X20.4 ; also sheet 1,2,3,4
MISO: WIFI.7(MISO) X20.3 ; also sheet 2,3
MOSI: WIFI.6(MOSI) X20.5 ; also sheet 1,2,3
N$157: R169.2 R170.2 X19.2
N$159: R171.2 R172.2 X19.3
SCLK: WIFI.5(SCLK) X20.9 ; also sheet 1,2,3
SYNC1: IC34.7(A:O) ; also sheet 2
SYNC2: IC34.1(A:I0) IC34.2(A:I1) IC34.3(B:O) ; also sheet 2
SYNC_IN: IC34.5(B:I0) IC34.6(B:I1) X16.7
WIFI_CE: WIFI.3(CE) ; also sheet 2
Unconnected: X20.1 X20.10

### Notes on the sheet
- Optional Ethernet module connector | Optional Wifi module connector | Rotary encoder (optional)
- 4-pin connector X19
- +3.3V 1
- A signal 2
- B signal 3
- Gnd 4
- 10-pin connector X20 | 8-pin WIFI connector
- N.C. (+3.3V out) 1 | Gnd 1
- 2 +5V | 2 +3.3V
- MISO 3 | CE 3
- 4 Gnd | 4 CSN
- MOSI 5 | SCLK 5
- 6 !RESET | 6 MOSI
- !ETH_SELECT! 7 | MISO 7
- 8 !ETH_IRQ | 8 IRQ
- SCLK 9
- 10 N.C.
- Solder WIFI on the PCB's opposite side
- Master sync signal phase shifting
- Optional ethernet, Wifi and encoder
- Power boards SMPS sync
- Licensed under the TAPR Open Hardware License (www.tapr.org/OHL)
- More info at http://www.envox.hr/eez
- Repository: https://github.com/eez-open

## Library data of the parts
C104 C105 C107-C110 C112-C118 C121-C126 C128-C143 C146-C156 = rcl:C-EU: CAPACITOR, European symbol
C106 C111 C120 = MyLib6:ECAP
C119 C144 C145 = EEZ_Lib1:ECAP
C127 = EEZ_Lib1:SUPER_CAP: Electric Double Layer Supercapacitors, Type EDL Vertical - Manufacturer Part No: EDLSG105V5R5C Farnell: 2113011 Horizontal - Manufacturer Part No: EDLSG105H5R5C Farnell: 1364209, 9697497
D22-D25 D27 = diode:DIODE-: DIODE
D26 = MyLib6:DIODE
D28 = diode:BAT54S: Schottky Diodes Pin connection corrected 2011-05-04 Source: Fairchild .. BAT54.pdf
D29 = EEZ_Lib1:SCHOTTKY
FB7 = EEZ_Lib1:FERRITE_BEAD: FAIR-RITE - 2506033007Y3 - FERRITE BEAD, 0.04OHM, 3A, 0603 Farnell: 2112873
FM5 FM6 = EEZ_Lib1:FIDUCIAL: Fiducial mark for pick and place automation
IC20 = MyLib6:TLC5925IDBQR: CONSTANT-CURRENT LED SINK DRIVER; MPN: TLC5925IDBQR; OC_FARNELL: 1694438; OC_NEWARK: 46P3784; PACKAGE: SOP-24; SUPPLIER: Texas Instruments
IC21 IC25 = EEZ_Lib1:SI8641: Low power 4-ch digital isolator (3+1) Farnell: 2423288
IC22 IC23 = EEZ_Lib1:SI8651: Low power 5-ch digital isolator (4+1); FARNELL: 2423323
IC24 = v-reg:LD117A?*: Low drop fixed and adjustable positive voltage regulators 1 A Source: http://www.st.com/stonline/products/literature/ds/7194/ld1117axx.pdf
IC26 = MyLib6:PCA21125: SPI-bus Real-Time Clock and calendar Farnell: 2400445
IC27 = MyLib6:AT25XXX: SPI Serial EEPROM, Supports SPI Modes 0 (0,0) and 3 (1,1) Atmel AT25128 128K (16 384 x 8) Farnell: 2345601 Atmel AT25256 256K (32 768 x 8) Farnell: 1841577 Atmel AT25512 512K (65 536 x 8) Farnell: 2345608
IC28 = EEZ_Lib1:W5500: The W5500 chip is a Hardwired TCP/IP embedded Ethernet controller that enables easier internet connection for embedded systems using SPI (Serial Peripheral Interface). Case TQFP48; TME: W5500
IC29 = MyLib6:BC857BS: PNP general purpose dual transistor
IC30 = MyLib6:LM555
IC31 = EEZ_Lib1:SN74LVC2G08DCTR: DUAL 2-INPUT POSITIVE-AND GATE; MPN: SN74LVC2G08DCTR; OC_FARNELL: 1470871; OC_NEWARK: 68K1120; PACKAGE: SSOP-8; SUPPLIER: Texas Instruments
IC32 = EEZ_Lib1:TPS3705XX: Processor supervisory circuit with power-fail; FARNELL: 2296066
IC33 = EEZ_Lib1:SN74LV1T34: Single Power Supply Single Buffer GATE CMOS Logic Level Shifter; FARNELL: 2499914
IC34 = EEZ_Lib1:SN74LVC2G02DCTR: NOR Gate, LVC Family, 2 Input, 32 mA, 1.65V to 5.5V, SSOP-8
J1-J5 = EEZ_Lib1:BINDING_POST
JP3 = jumper:JP1E: JUMPER
JP4-JP8 = jump-0r-smd:0R-JUMP: SMD 0R 0805 Jumper
K_PAR K_SER = EEZ_Lib1:RELAY_RT314012
K_S1 K_S2 = relay:G6K: Low Signal Relay oeiwcsnts1.omron.com/.. D20G6K0100.pdf; MF: OMRON COMPONENTS USA; MPN: G6K-2F DC24; OC_FARNELL: 1690427; OC_NEWARK: 36K7467
LCD1 = EEZ_Lib1:LCD_TFT_320QVT: 3.2" 320x240 TFT Module Display Touch Panel with PCB 262K Colors IC SSD1289
LED_CC1 LED_CC2 LED_CV1 LED_CV2 LED_O1 LED_O2 LED_PROG1 LED_PROG2 LED_PWR LED_S1 LED_S2 LED_SP = EEZ_Lib1:LED
MCU = EEZ_Lib1:ARDUINO_MEGA+ICSP
OK3 = EEZ_Lib1:HCPL-181: Phototransistor Optocoupler SMD Mini-Flat Type
Q23-Q26 Q28 = MyLib6:IRLML2246TRPBF: HEXFET Power MOSFET (-20V, -2.6A); MPN: IRLML2246TRPBF; OC_FARNELL: 1888166; OC_NEWARK: 40T7450; PACKAGE: SOT-3; SUPPLIER: International Rectifier; TME: IRLML2246TRPBF
Q27 Q29 Q30 = MyLib6:2N7002: N-CHANNEL ENHANCEMENT MODE FIELD EFFECT TRANSISTOR; MPN: 2N7002-7-F; OC_FARNELL: 1713823; OC_NEWARK: 25R5679; PACKAGE: SOT-23-3; SUPPLIER: DIODES INC.
R134-R172 = rcl:R-EU_: RESISTOR, European symbol
RN1 RN2 = EEZ_Lib1:R_ARRAY4: 1206 four resistor array
SH3 = EEZ_Lib1:SHORT
SP1 = EEZ_Lib1:BUZZER: Loudity LD-BZEN-0903 Sound transducer: electromagnetic; without built-in generator; TME: LD-BZEN-0903
SW1 = switch:M9040P: TOGGLE SWITCH Marquardt
SW2 = EEZ_Lib1:TACT_SW
TP2 TP3 = EEZ_Lib1:TEST_POINT: Test point for oscilloscope probe
WIFI = EEZ_Lib1:MOD-NRF24L01: Nordic nRF24L01, highly integrated, ultra low power (ULP) 2Mbps RF transceiver for the 2.4GHz
X12 = EEZ_Lib1:MC000006: Wire-To-Board Terminal Block, 8, 150 V, 6 A, 26 AWG, 20 AWG No. of Positions:8; Rated Voltage:150V; Rated Current:6A; FARNELL: 2007972
X13 X15 = EEZ_Lib1:TSW-113-07-F-D: Samtec TSW-110-07-F-D Header, 2.54MM, THT, 26-way; FARNELL: 2025182
X14 = EEZ_Lib1:MC000005: Wire-To-Board Terminal Block, 6, 150 V, 6 A, 26 AWG, 20 AWG No. of Positions:6; Rated Voltage:150V; Rated Current:6A
X16 = EEZ_Lib1:IDC-10PIN: 10-pin IDC socket male, straight; TME: T821-1-10-S1
X17 = con-molex:22-23-2021: .100" (2.54mm) Center Header - 2 Pin; MF: MOLEX; MPN: 22-23-2021; OC_FARNELL: 1462926; OC_NEWARK: 25C3832
X18 = con-samtec:SSW-108-02-S-S: THROUGH-HOLE .025" SQ POST SOCKET Source: Samtec SSW.pdf; MPN: SSW-108-02-S-S; OC_FARNELL: unknown; OC_NEWARK: 11P9448
X19 = con-molex:22-23-2041: .100" (2.54mm) Center Header - 4 Pin; MF: MOLEX; MPN: 22-23-2041; OC_FARNELL: 1462920; OC_NEWARK: 38C0355
X20 = con-samtec:SSW-105-02-S-D: THROUGH-HOLE .025" SQ POST SOCKET Source: Samtec SSW.pdf; MPN: SSW-105-02-S-D; OC_FARNELL: unknown; OC_NEWARK: 11P9398
Y1 Y2 = MyLib6:XTAL
ZD8-ZD11 = EEZ_Lib1:PSMAXX: Transient Voltage Suppressor, TVS, P4SMA Series, Unidirectional
ZD12 = EEZ_Lib1:ZENER-DIODE

## Net classes
0 default: width 0.254 mm, drill 0.584 mm, clearance 0.254 mm
1 dgnd: width 0.254 mm, drill 0.584 mm, clearance 0.254 mm
2 gnd: width 0.254 mm, drill 0.584 mm, clearance 0.254 mm